# Altium project pmu.PrjPcb
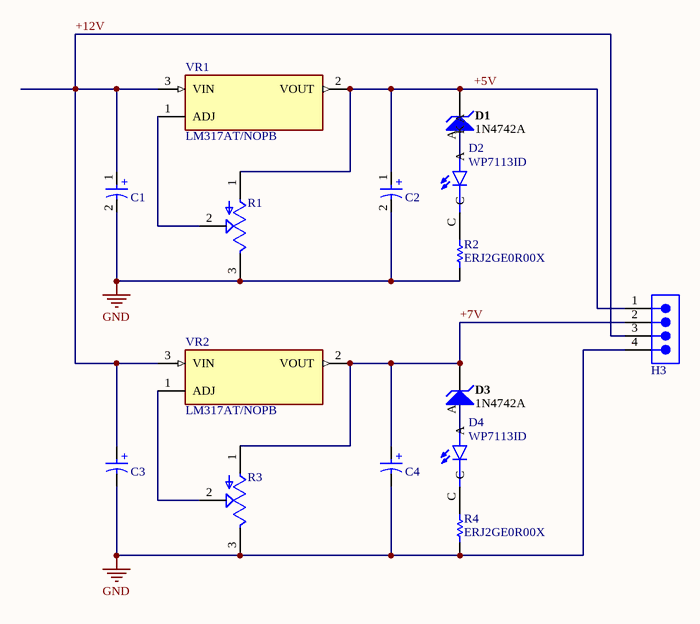
[diagram p0: pmu.SchDoc]
1 sheet, 15 parts. Net scope: global (net labels, ports and power ports of the same name join across sheets).
Board file: pmu.PcbDoc

## Sheet pmu.SchDoc
size A; SheetNumber: 1; SheetTotal: 1; SPICEModelCacheIUZUPHTK: <root> / <DocumentId>IUZUPHTK</DocumentId> / <CacheFrame Number="0"> / <Model Name="860020672006_2.2uf" Kind="CKT"> / <Text>******* / .subckt 860020672006_2.2uF 1 2 / Rser 1 3 2.32277177427 / Lser 2 4 5.676908907E-09 / C1 3 4 0.0000022 / Rpar 3 4 16666666.6666667 / .ends 860020672006_2.2uF</Text> / </Model> / </CacheFrame> / </root>

### Parts
C1  2.2µF  [WCAP-ATG5_D5H11]  (value not drawn)
C2  1.1uF  [WCAP-ATG5_D5H11]  (value not drawn)
C3  2.2µF  [WCAP-ATG5_D5H11]  (value not drawn)
C4  1.1uF  [WCAP-ATG5_D5H11]  (value not drawn)
D1  1N4742A  [FAIR-DO-41-2_V]
D2  WP7113ID  [LED_WP7113ID]
D3  1N4742A  [FAIR-DO-41-2_V]
D4  WP7113ID  [LED_WP7113ID]
H3  61300411121  [61300411121]  (value not drawn)
R1  (no value)  [TRIM_3362P-1-103LF]
R2  ERJ2GE0R00X  [RESC1005X40X25LL05T05]
R3  (no value)  [TRIM_3362P-1-103LF]
R4  ERJ2GE0R00X  [RESC1005X40X25LL05T05]
VR1  LM317AT/NOPB  [TO254P1054X470X1955-3]
VR2  LM317AT/NOPB  [TO254P1054X470X1955-3]

### Nets
GND: C1.2(N) C2.2(N) C3.2(N) C4.2(N) H3.4 R1.3(CW) R2.1 R3.3(CW) R4.1
+5V: C2.1(P) D1.2(K) H3.1 R1.1(CCW) VR1.2(VOUT)
+7V: C4.1(P) D3.2(K) H3.2 R3.1(CCW) VR2.2(VOUT)
+12V: C1.1(P) C3.1(P) H3.3 VR1.3(VIN) VR2.3(VIN)
NetD1_1: D1.1(A) D2.A
NetD2_C: D2.C R2.2
NetD3_1: D3.1(A) D4.A
NetD4_C: D4.C R4.2
NetR1_2: R1.2(WIPER) VR1.1(ADJ)
NetR3_2: R3.2(WIPER) VR2.1(ADJ)

### Notes on the sheet
- (in symbol 860020672006) +

### Library data of the parts
C1-C4 = 860020672006: WCAP-ATG5 Aluminum Electrolytic Capacitor, Radial, THT, D5 x H11mm, 2.2µF, 50V; Manufacturer: Wurth Elektronik; Capacitance Tolerance: +/-20%; Dissipation Factor: 10%; Endurance: 2000h; Leakage Current: 3µA; Ripple Current: 20mA; Technical Reference: ATDC1102R2M050DSPA3B000; Manufacturer Part Number: 860020672006; Category: Aluminum Electrolytic Capacitors; Match Code: WCAP-ATG5; ComponentLink1Description: Website Link; ComponentLink1URL: https://www.we-online.com/redexpert/article/860020672006?ad; ComponentLink2Description: Datasheet Link; ComponentLink2URL: https://www.we-online.com/redexpert/spec/860020672006?ad; Mount: Through Hole; Operating Temperature Max: 105°C; Operating Temperature Min: -40°C; Packaging: Ammo Pack; Height: 11mm; Diameter: 5mm; Capacitance: 2.2µF; Rated Voltage (DC): 50V
D1 D3 = CMP-0892-00001-1: Zener Diode, 12V, 1W, 5%, -65 to 200 degC, 2-Pin DO-41, Body 2.72 x 5.2 mm, RoHS; Manufacturer: Fairchild Semiconductor; PD (W): 1; VZ (Min.) (V): 11.4; VZ (Max.) (V): 12.6; ZZ (Max) (ohm): 8; IR (uA): 5; Test Current IZ (mA): 21; PartNumber: 1N4742A; PackageVersion: Rev. 2; DatasheetVersion: Rev. H3; Mounting Technology: Through Hole; Tolerance: 5%; PackageDescription: 2-Pin Axial leaded, Body 2.72 x 5.2 mm, Lead Spread 25.4 mm; ComponentLink1Description: Manufacturer URL; ComponentLink3Description: Package Specification; ComponentLink2Description: Datasheet; ComponentLink2URL: http://www.fairchildsemi.com/ds/1N/1N4744A.pdf; PackageReference: DO-41-2; RoHS: TRUE; Operating and Storage Temperature Range: -65 to 200 degC; ComponentLink3URL: http://www.fairchildsemi.com/dwg/DO/DO41A.pdf; ComponentLink1URL: http://www.fairchildsemi.com/
D2 D4 = WP7113ID: Red 617nm LED Indication - Discrete 2V Radial; MF: Kingbright; Price: None; MP: WP7113ID; Package: Radial Kingbright; Check_prices: https://www.snapeda.com/parts/WP7113ID/Kingbright/view-part/?ref=eda; Purchase-URL: https://pricing.snapeda.com/search/part/WP7113ID/?ref=eda; Availability: In Stock; Value: *; SnapEDA_Link: https://www.snapeda.com/parts/WP7113ID/Kingbright/view-part/?ref=snap
H3 = 61300411121: WR-PHD Pin Header, THT, Vertical, pitch 2.54mm, 1 Row, 4P; Manufacturer: Wurth Elektronik; Contact Resistance: 20mOhm; Rated Current: 3A; Working Voltage: 250V; Withstanding Voltage: 500V; Manufacturer Part Number: 61300411121; Category: Board-to-Board Connectors; Match Code: WR-PHD; ComponentLink1Description: Website Link; ComponentLink1URL: https://www.we-online.com/redexpert/article/61300411121?ad; ComponentLink2Description: Datasheet Link; ComponentLink2URL: https://www.we-online.com/redexpert/spec/61300411121?ad; Mount: Through Hole; Operating Temperature Max: 105°C; Operating Temperature Min: -40°C; Packaging: Bag; Gender: Pin Header; Number of Pins: 4; Number of Rows: 1; Orientation: Vertical; Pitch: 2.54mm
R1 R3 = 3362P-1-103LF: 10 kOhms 0.5W, 1/2W PC Pins Through Hole Trimmer Potentiometer Cermet 1 Turn Top Adjustment; MF: Bourns; Check_prices: https://www.snapeda.com/parts/3362P-1-103LF/Bourns/view-part/13764/?ref=eda; Digi-Key_Part_Number: 3362P-103LF-ND; Value: *; Package: 3116 Bourns; SnapEDA_Link: https://www.snapeda.com/parts/3362P-1-103LF/Bourns/view-part/13764/?ref=snap; Purchase-URL: https://pricing.snapeda.com/search/part/3362P-1-103LF/?ref=eda; MP: 3362P-1-103LF
R2 R4 = CMP-2000-07451-1: Chip Resistor, 0 Ohm, 0.1 W, -55 to 155 degC, 0402 (1005 Metric), RoHS, Tape and Reel; Manufacturer: Panasonic; Voltage Rating (DC): 50V; Temperature Coefficient: 600ppm/��C; Max Power Dissipation: 100mW; Resistance: 0mOhm; Tolerance: 5%; Number of Terminations: 2; Mount: SurfaceMount; Height: 0.35mm; Packaging: TapeandReel; Contact Plating: Tin; Manufacturer URL: http://www.panasonic.com/; Composition: ThickFilm; Max Operating Temperature: 155degC; REACH SVHC: NoSVHC; Case/Package: 0402; Package Reference: 402; Depth: 0.5mm; Package Description: 2-Pin Surface Mount Device, Body 1 x 0.5 mm; Datasheet URL: https://industrial.panasonic.com/cdbs/www-data/pdf/RDA0000/AOA0000C301.pdf; RoHSCompliant: True; Case Code (Imperial): 0402; Military Standard: Not; Min Operating Temperature: -55degC; Power Rating: 100mW; Datasheet Version: 03/2015; Length: 1mm; Case Code (Metric): 1005; Termination: SMD/SMT; Mounting Technology: SurfaceMount; Voltage Rating: 50V; Width: 0.02inch; Package Quantity: 1; Lead Free: LeadFree; Radiation Hardening: No
VR1 VR2 = LM317AT/NOPB: MP: LM317AT/NOPB; Availability: Unavailable; Value: *; Package: None; Price: None